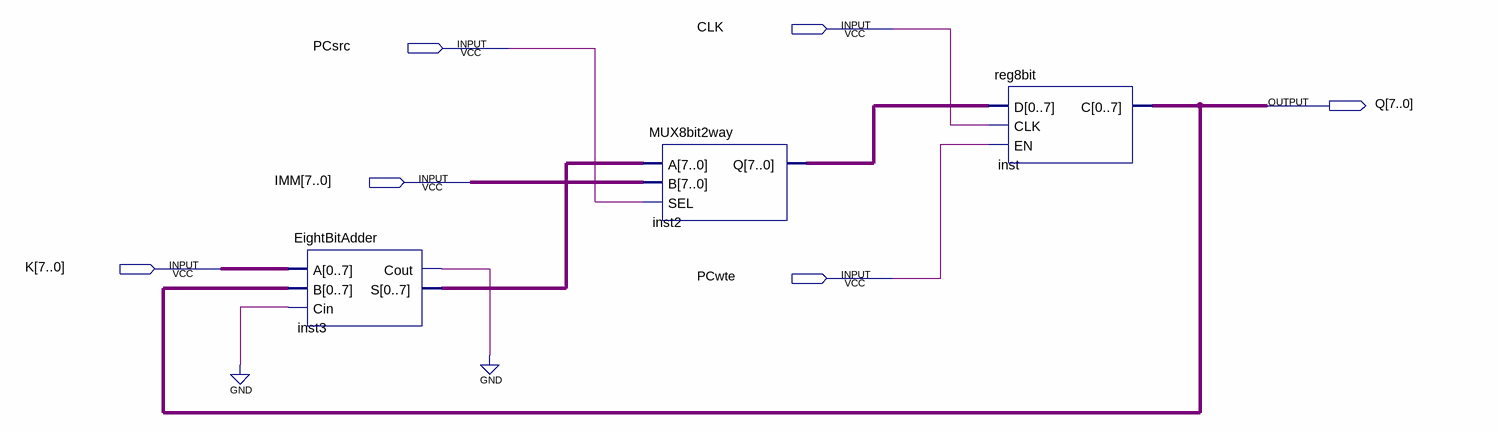
[diagram p0: schematic sheet]
// Quartus schematic PC8bit.bdf as structural Verilog: 3 symbols, 6 pins
module PC8bit (
  input  CLK,
  input  PCsrc,
  input  [7:0] IMM,
  input  [7:0] K,
  input  PCwte,
  output [7:0] Q
);

  wire inst3_cout;
  wire [7:0] inst2_q, inst3_s;

  EightBitAdder inst3 (.A(K), .B(Q), .Cin(1'b0), .Cout(inst3_cout), .S(inst3_s));
  MUX8bit2way inst2 (.A(inst3_s), .B(IMM), .SEL(PCsrc), .Q(inst2_q));
  reg8bit inst (.D(inst2_q), .CLK(CLK), .EN(PCwte), .C(Q));
  // also tied to GND on the sheet: inst3_cout
endmodule
